# Altium project 海关全向控制器按键板V2.PrjPcb
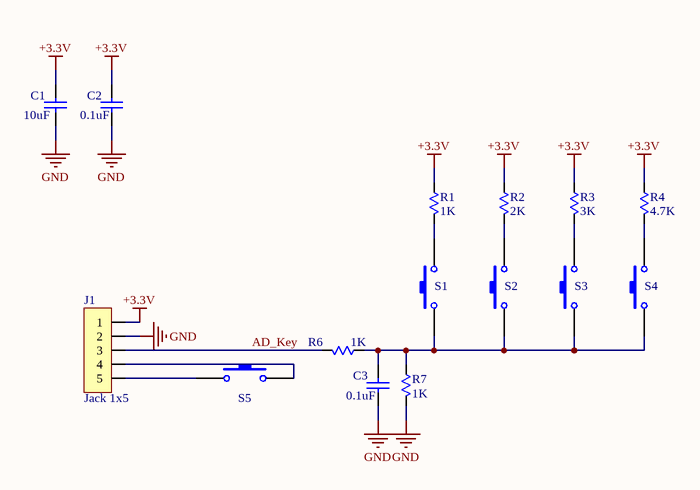
[diagram p0: 海关全向控制器按键板V2.SchDoc]
1 sheet, 15 parts. Net scope: global (net labels, ports and power ports of the same name join across sheets).
Board file: 海关全向控制器按键板V2.PcbDoc

## Sheet 海关全向控制器按键板V2.SchDoc
size A4

### Parts
C1  10uF  [C0603]
C2  0.1uF  [C0603]
C3  0.1uF  [C0603]
J1  Jack 1x5  [ZH-5AWD]
R1  1K  [R0603]
R2  2K  [R0603]
R3  3K  [R0603]
R4  4.7K  [R0603]
R6  1K  [R0603]
R7  1K  [R0603]
S1  SW-PB  [SW3X6X5]  (value not drawn)
S2  SW-PB  [SW3X6X5]  (value not drawn)
S3  SW-PB  [SW3X6X5]  (value not drawn)
S4  SW-PB  [SW3X6X5]  (value not drawn)
S5  SW-PB  [SW3X6X5]  (value not drawn)

### Nets
+3.3V: C1.2 C2.2 J1.1 R1.2 R2.2 R3.2 R4.2
GND: C1.1 C2.1 C3.1 J1.2 R7.1
AD_Key: J1.3 R6.1
NetC3_2: C3.2 R6.2 R7.2 S1.1 S2.1 S3.1 S4.1
NetJ1_4: J1.4 S5.2
NetJ1_5: J1.5 S5.1
NetR1_1: R1.1 S1.2
NetR2_1: R2.1 S2.2
NetR3_1: R3.1 S3.2
NetR4_1: R4.1 S4.2

### Library data of the parts
C1-C3 = CAP: Published: 8-Jun-2000; LatestRevisionDate: 17-Jul-2002; LatestRevisionNote: Re-released for DXP Platform.; PackageReference: RAD-0.3; Publisher: Altium Limited
  C1: Value: 10uF
  C2 C3: Value: 0.1uF
J1 = Jack 1x5: 插座
R1-R4 R6 R7 = Res: Resistor; Published: 8-Jun-2000; LatestRevisionDate: 04-Mar-2005; LatestRevisionNote: PCB Footprint replaced.; PackageReference: J1-0603; Publisher: Altium Limited
S1-S5 = SW-PB: Switch; Published: 24-Mar-1999; LatestRevisionDate: 17-Jul-2002; LatestRevisionNote: Re-released for DXP Platform.; PackageReference: SPST-2; Publisher: Altium Limited; PackageDescription: Switch; 2 Leads